# Altium schematic sheet Radio Transceiver.SchDoc
size A; SheetNumber: 1; SheetTotal: 17
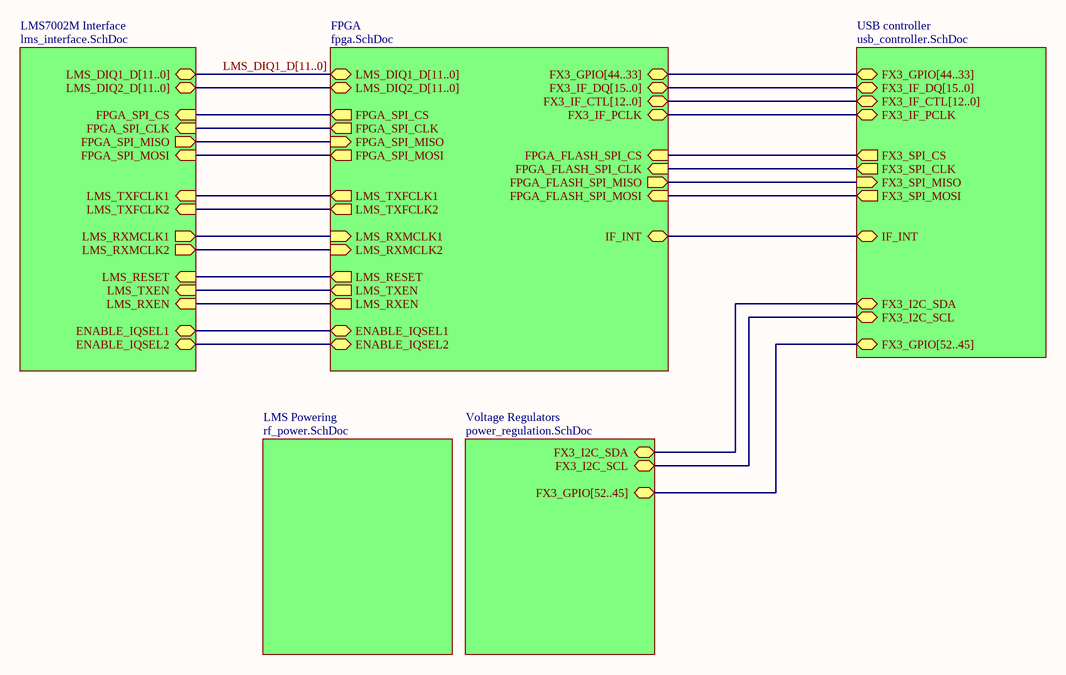
[diagram p0: Radio Transceiver.SchDoc]

## Sub-sheets
FPGA = fpga.SchDoc: LMS_DIQ1_D[11..0] (bidir), LMS_DIQ2_D[11..0] (bidir), FPGA_FLASH_SPI_CS (in), FPGA_FLASH_SPI_CLK (in), FPGA_FLASH_SPI_MISO (out), FPGA_FLASH_SPI_MOSI (in), FPGA_SPI_CS (out), FPGA_SPI_CLK (out), FPGA_SPI_MISO (in), FPGA_SPI_MOSI (out), LMS_TXFCLK1 (out), LMS_TXFCLK2 (out), LMS_RXMCLK1 (in), LMS_RXMCLK2 (in), FX3_GPIO[44..33] (bidir), FX3_IF_DQ[15..0] (bidir), FX3_IF_CTL[12..0] (bidir), FX3_IF_PCLK (bidir), LMS_RESET (out), LMS_TXEN (out), LMS_RXEN (out), ENABLE_IQSEL1 (bidir), ENABLE_IQSEL2 (bidir), IF_INT (bidir)
LMS7002M Interface = lms_interface.SchDoc: LMS_DIQ1_D[11..0] (bidir), FPGA_SPI_CS (in), FPGA_SPI_CLK (in), FPGA_SPI_MISO (out), FPGA_SPI_MOSI (in), LMS_DIQ2_D[11..0] (bidir), LMS_TXFCLK1 (in), LMS_TXFCLK2 (in), LMS_RXMCLK1 (out), LMS_RXMCLK2 (out), LMS_RESET (in), LMS_TXEN (in), LMS_RXEN (in), ENABLE_IQSEL1 (bidir), ENABLE_IQSEL2 (bidir)
LMS Powering = rf_power.SchDoc: no entries
USB controller = usb_controller.SchDoc: FX3_SPI_CS (out), FX3_SPI_CLK (out), FX3_SPI_MISO (in), FX3_SPI_MOSI (out), FX3_GPIO[44..33] (bidir), FX3_IF_DQ[15..0] (bidir), FX3_IF_CTL[12..0] (bidir), FX3_GPIO[52..45] (bidir), FX3_I2C_SCL (bidir), FX3_I2C_SDA (bidir), FX3_IF_PCLK (bidir), IF_INT (bidir)
Voltage Regulators = power_regulation.SchDoc: FX3_GPIO[52..45] (bidir), FX3_I2C_SCL (bidir), FX3_I2C_SDA (bidir)

## Nets
(unnamed): sheet FPGA/FPGA_FLASH_SPI_CS, sheet USB controller/FX3_SPI_CS
(unnamed): sheet FPGA/FPGA_FLASH_SPI_CLK, sheet USB controller/FX3_SPI_CLK
(unnamed): sheet FPGA/FPGA_FLASH_SPI_MISO, sheet USB controller/FX3_SPI_MISO
(unnamed): sheet FPGA/FPGA_FLASH_SPI_MOSI, sheet USB controller/FX3_SPI_MOSI
(unnamed): sheet FPGA/FPGA_SPI_CS, sheet LMS7002M Interface/FPGA_SPI_CS
(unnamed): sheet FPGA/FPGA_SPI_CLK, sheet LMS7002M Interface/FPGA_SPI_CLK
(unnamed): sheet FPGA/FPGA_SPI_MISO, sheet LMS7002M Interface/FPGA_SPI_MISO
(unnamed): sheet FPGA/FPGA_SPI_MOSI, sheet LMS7002M Interface/FPGA_SPI_MOSI
(unnamed): sheet FPGA/LMS_TXFCLK1, sheet LMS7002M Interface/LMS_TXFCLK1
(unnamed): sheet FPGA/LMS_TXFCLK2, sheet LMS7002M Interface/LMS_TXFCLK2
(unnamed): sheet FPGA/LMS_RXMCLK1, sheet LMS7002M Interface/LMS_RXMCLK1
(unnamed): sheet FPGA/LMS_RXMCLK2, sheet LMS7002M Interface/LMS_RXMCLK2
(unnamed): sheet FPGA/FX3_IF_PCLK, sheet USB controller/FX3_IF_PCLK
(unnamed): sheet FPGA/LMS_RESET, sheet LMS7002M Interface/LMS_RESET
(unnamed): sheet FPGA/LMS_TXEN, sheet LMS7002M Interface/LMS_TXEN
(unnamed): sheet FPGA/LMS_RXEN, sheet LMS7002M Interface/LMS_RXEN
(unnamed): sheet FPGA/ENABLE_IQSEL1, sheet LMS7002M Interface/ENABLE_IQSEL1
(unnamed): sheet FPGA/ENABLE_IQSEL2, sheet LMS7002M Interface/ENABLE_IQSEL2
(unnamed): sheet FPGA/IF_INT, sheet USB controller/IF_INT
(unnamed): sheet USB controller/FX3_I2C_SCL, sheet Voltage Regulators/FX3_I2C_SCL
(unnamed): sheet USB controller/FX3_I2C_SDA, sheet Voltage Regulators/FX3_I2C_SDA

## Buses and harness runs
bus LMS_DIQ1_D[11..0] = sheet FPGA/LMS_DIQ1_D[11..0] = sheet LMS7002M Interface/LMS_DIQ1_D[11..0]
bus sheet FPGA/FX3_GPIO[44..33] = sheet USB controller/FX3_GPIO[44..33]
bus sheet FPGA/FX3_IF_CTL[12..0] = sheet USB controller/FX3_IF_CTL[12..0]
bus sheet FPGA/FX3_IF_DQ[15..0] = sheet USB controller/FX3_IF_DQ[15..0]
bus sheet FPGA/LMS_DIQ2_D[11..0] = sheet LMS7002M Interface/LMS_DIQ2_D[11..0]
bus sheet USB controller/FX3_GPIO[52..45] = sheet Voltage Regulators/FX3_GPIO[52..45]